# Altium schematic sheet Sheet1.SchDoc
size 594 x 420 mm; Scale: 1:1; Разраб.: Тимофеев; Обозначение документа: 5759-05-12-20 УП6359 Э3; Пров.: Никоноров; Утв.: Токарев; Наименование организации: ООО "ПО"Зарница"; Перв. применение: 5759-05-12-20 УП6359; Наименование изделия 1: Uni_mp3_v2_00; Наименование изделия 2: Схема электрическая; Наименование изделия 3: принципиальная; Нач. отд.: Нач. отд.; Фамилия нач. отд.: Никоноров
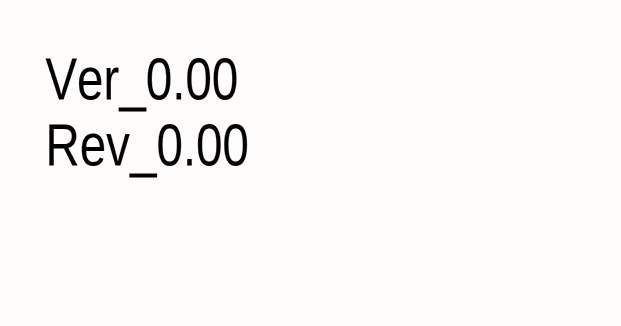
[diagram p0: Sheet1.SchDoc]

## Notes on the sheet
- Ver_0.00
  Rev_0.00
- Перв. примен.
- Справ. №
- Подп. и дата
- Инв. № дубл.
- Взам. инв. №
- Разраб.
- Изм.
- Лист
- № докум.
- Подп.
- Дата
- Лит.
- Масса
- Масштаб
- Пров.
- Т.контр.
- Листов
- Инв. № подл.
- Утв.
- Н.контр.
- Копировал
- Формат А2